# Altium project DAPLink-STM32F103CBT6.PrjPcb
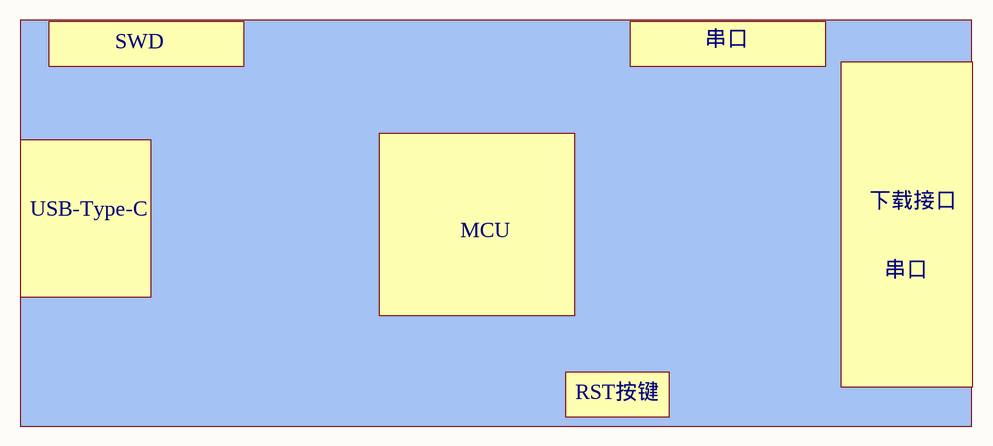
[diagram p0: 01-CoverPage.SchDoc]
website: aiskylab.com
2 sheets, 37 parts. Net scope: global (net labels, ports and power ports of the same name join across sheets).
Board file: DAPLink-STM32F103CBT6.PcbDoc
Sheets:
  01-CoverPage.SchDoc
  02-DAPLink-STM32F103CBT6.SchDoc

## Sheet 01-CoverPage.SchDoc: =DocumentName
size A3; ApprovedBy: 雪域蓝天; CheckedBy: 雪域蓝天; Author: 雪域蓝天; CompanyName: AISkyLab; DrawnBy: 雪域蓝天; Engineer: 雪域蓝天; Organization: AISkyLab; Address1: 海淀; Address3: 北京; Address4: 中国; DocumentNumber: 1; Revision: V1I1; SheetNumber: 1; SheetTotal: 2; ENG_APP_DATE: --/--/--; DSN_APP_DATE: --/--/--; CHK_APP_DATE: --/--/--; website: aiskylab.com

### Notes on the sheet
- 串口
- SWD
- USB-Type-C
- MCU
- 下载接口
- RST按键
- 公
- 设计
- 日期
- 司
- 绘制
- 审核
- 批准
- 标题(Title):
- Size:
- Date:
- A3
- Number:
- Time:
- Revision:
- Sheet
- of
- File:

## Sheet 02-DAPLink-STM32F103CBT6.SchDoc: =DocumentName
size A3; ApprovedBy: 雪域蓝天; CheckedBy: 雪域蓝天; Author: 雪域蓝天; CompanyName: AISkyLab; DrawnBy: 雪域蓝天; Engineer: 雪域蓝天; Organization: AISkyLab; Address1: 海淀; Address2: 北京; Address4: 中国; DocumentNumber: 2; Revision: V1I1; SheetNumber: 2; SheetTotal: 2; ENG_APP_DATE: --/--/--; DSN_APP_DATE: --/--/--; CHK_APP_DATE: --/--/--
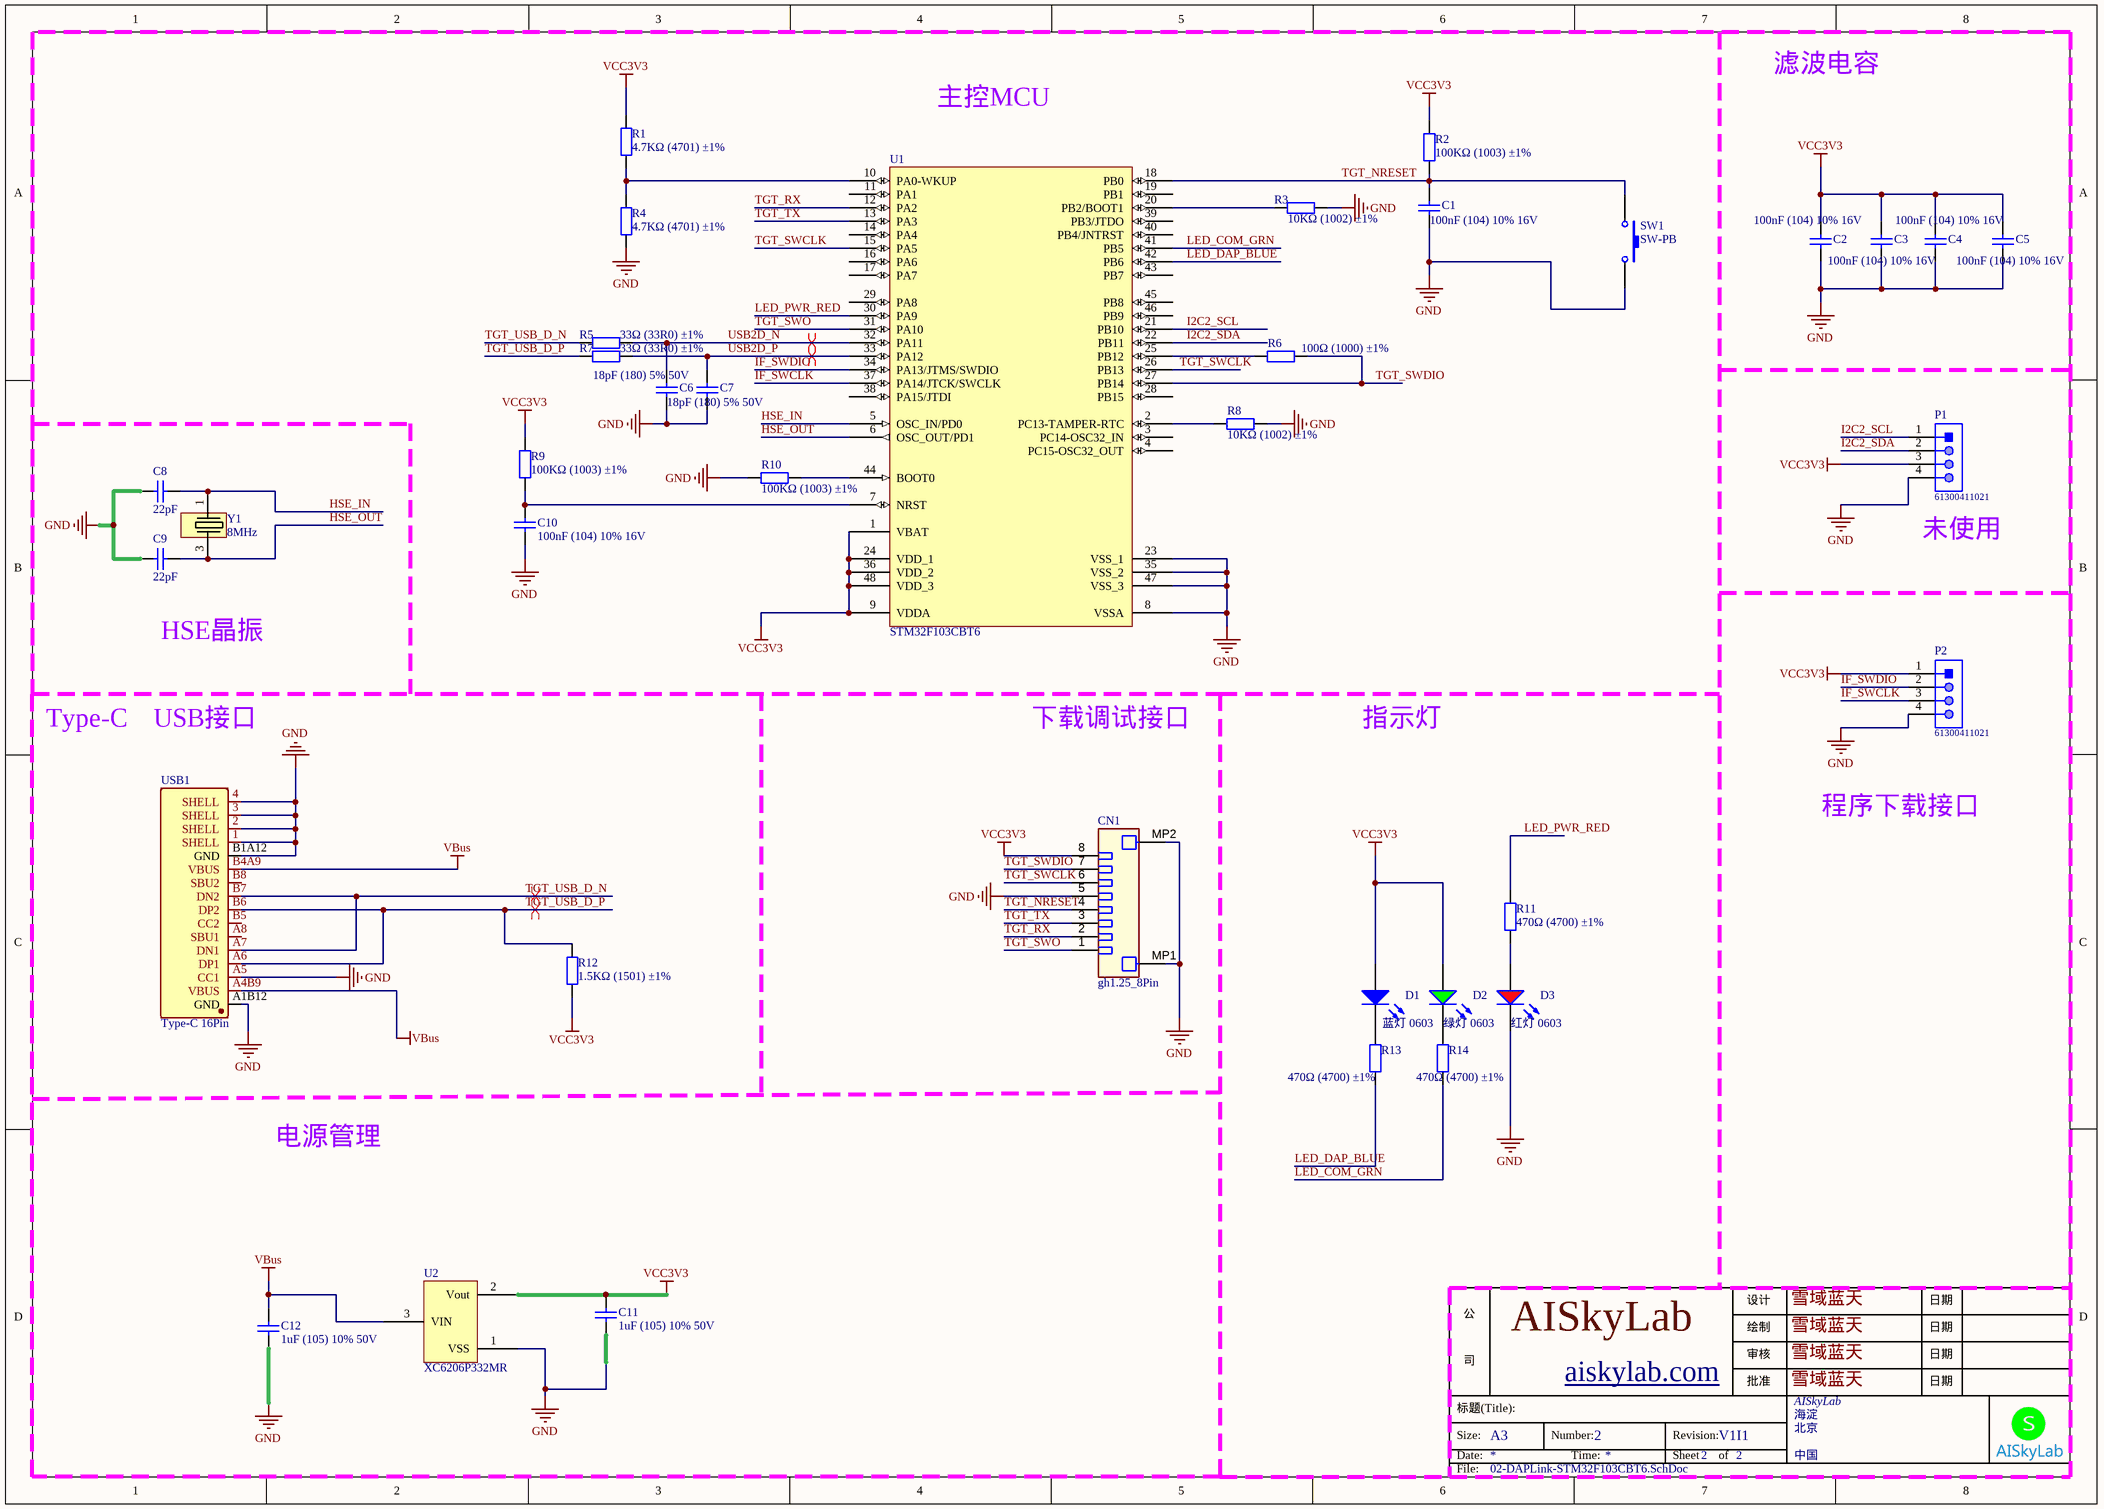
[diagram p1: 02-DAPLink-STM32F103CBT6.SchDoc]

### Parts
C1  100nF (104) 10% 16V  [0402_C]
C2  100nF (104) 10% 16V  [0402_C]
C3  100nF (104) 10% 16V  [0402_C]
C4  100nF (104) 10% 16V  [0402_C]
C5  100nF (104) 10% 16V  [0402_C]
C6  18pF (180) 5% 50V  [0402_C]
C7  18pF (180) 5% 50V  [0402_C]
C8  22pF  [0603_C]
C9  22pF  [0603_C]
C10  100nF (104) 10% 16V  [0402_C]
C11  1uF (105) 10% 50V  [0603_C]
C12  1uF (105) 10% 50V  [0603_C]
CN1  gh1.25_8Pin  [GH1.25_SMD_R_8Pin]
D1  蓝灯 0603  [0603_LED_S1]
D2  绿灯 0603  [0603_LED_S1]
D3  红灯 0603  [0603_LED_S1]
P1  61300411021  [HDR-2.54-1x4-VB2B]
P2  61300411021  [HDR-2.54-1x4-VB2B]
R1  4.7KΩ (4701) ±1%  [0402_R]
R2  100KΩ (1003) ±1%  [0402_R]
R3  10KΩ (1002) ±1%  [0402_R]
R4  4.7KΩ (4701) ±1%  [0402_R]
R5  33Ω (33R0) ±1%  [0402_R]
R6  100Ω (1000) ±1%  [0402_R]
R7  33Ω (33R0) ±1%  [0402_R]
R8  10KΩ (1002) ±1%  [0402_R]
R9  100KΩ (1003) ±1%  [0402_R]
R10  100KΩ (1003) ±1%  [0402_R]
R11  470Ω (4700) ±1%  [0402_R]
R12  1.5KΩ (1501) ±1%  [0402_R]
R13  470Ω (4700) ±1%  [0402_R]
R14  470Ω (4700) ±1%  [0402_R]
SW1  SW-PB  [PB_TYCO_FSMSM]
U1  STM32F103CBT6  [STM32F103CBT6-Footprint-1]
U2  XC6206P332MR  [SOT95P245X110-3N]
USB1  Type-C 16Pin  [PCBComponent_1]
Y1  8MHz  [OSC_SI-TIME_SIT1602-2]

### Nets
GND: C1.1 C2.1 C3.1 C4.1 C5.1 C6.1 C7.1 C8.1 C9.1 C10.1 C11.1 C12.1 CN1.5 CN1.MP1 CN1.MP2 D3.K P1.4 P2.4 R3.2 R4.1 R8.2 R10.2 SW1.2 U1.8(VSSA) U1.23(VSS_1) U1.35(VSS_2) U1.47(VSS_3) U2.1(VSS) USB1.1(SHELL) USB1.2(SHELL) USB1.3(SHELL) USB1.4(SHELL) USB1.A1B12(GND) USB1.A5(CC1) USB1.B1A12(GND)
VBus: C12.2 U2.3(VIN) USB1.A4B9(VBUS) USB1.B4A9(VBUS)
VCC3V3: C2.2 C3.2 C4.2 C5.2 C11.2 CN1.8 D1.A D2.A P1.3 P2.1 R1.2 R2.2 R9.2 R12.1 U1.1(VBAT) U1.9(VDDA) U1.24(VDD_1) U1.36(VDD_2) U1.48(VDD_3) U2.2(Vout)
HSE_IN: C8.2 U1.5(OSC_IN/PD0) Y1.1
HSE_OUT: C9.2 U1.6(OSC_OUT/PD1) Y1.3
I2C2_SCL: P1.1 U1.21(PB10)
I2C2_SDA: P1.2 U1.22(PB11)
IF_SWCLK: P2.3 U1.37(PA14/JTCK/SWCLK)
IF_SWDIO: P2.2 U1.34(PA13/JTMS/SWDIO)
LED_COM_GRN: R14.1 U1.41(PB5)
LED_DAP_BLUE: R13.1 U1.42(PB6)
LED_PWR_RED: R11.2 U1.30(PA9)
TGT_NRESET: C1.2 CN1.4 R2.1 SW1.1 U1.18(PB0)
TGT_RX: CN1.2 U1.12(PA2)
TGT_SWCLK: CN1.6 U1.15(PA5) U1.26(PB13)
TGT_SWDIO: CN1.7 R6.2 U1.27(PB14)
TGT_SWO: CN1.1 U1.31(PA10)
TGT_TX: CN1.3 U1.13(PA3)
TGT_USB_D_N: R5.1 USB1.A7(DN1) USB1.B7(DN2)
TGT_USB_D_P: R7.1 R12.2 USB1.A6(DP1) USB1.B6(DP2)
USB2D_N: C6.2 R5.2 U1.32(PA11)
USB2D_P: C7.2 R7.2 U1.33(PA12)
NetC10_2: C10.2 R9.1 U1.7(NRST)
NetD1_K: D1.K R13.2
NetD2_K: D2.K R14.2
NetD3_A: D3.A R11.1
NetR1_1: R1.1 R4.2 U1.10(PA0-WKUP)
NetR3_1: R3.1 U1.20(PB2/BOOT1)
NetR6_1: R6.1 U1.25(PB12)
NetR8_1: R8.1 U1.2(PC13-TAMPER-RTC)
NetR10_1: R10.1 U1.44(BOOT0)

Not connected (* = marked no-connect by the designer): U1 3(PC14-OSC32_IN) 4(PC15-OSC32_OUT) 11(PA1) 14(PA4) 16(PA6) 17(PA7) 19(PB1) 28(PB15) 29(PA8) 38(PA15/JTDI) 39(PB3/JTDO) 40(PB4/JNTRST) 43(PB7) 45(PB8) 46(PB9); USB1 A8(SBU1) B5(CC2) B8(SBU2); Y1 2(GND) 4(GND)

### Layout directives
differential pair; differential pair class USB2Diff: TGT_USB_D_N, TGT_USB_D_P, USB2D_N, USB2D_P

### Notes on the sheet
- 主控MCU
- 滤波电容
- (near P1) 未使用
- HSE晶振
- Type-C    USB接口
- 下载调试接口
- 指示灯
- 程序下载接口
- 电源管理
- 公
- 设计
- 日期
- 司
- 绘制
- 审核
- 批准
- 标题(Title):
- Size:
- Date:
- A3
- Number:
- Time:
- Revision:
- Sheet
- of
- File:

### Library data of the parts
C1-C5 C10 = 0402 100nF (104) 10% 16V: 贴片电容; ComponentLink1Description: 供应商链接; ComponentLink1URL: http://www.szlcsc.com/product/details_1877.html; Package: 0402; Supplier: LC; SuppliersPartNumber: C1525
C6 C7 = 0402 18pF (180) 5% 50V: 贴片电容; ComponentLink1Description: 供应商链接; ComponentLink1URL: http://www.szlcsc.com/product/details_1901.html; Package: 0402; Supplier: LC; SuppliersPartNumber: C1549
C8 C9 = Cap: Capacitor; Published: 8-Jun-2000; LatestRevisionDate: 17-Jul-2002; LatestRevisionNote: Re-released for DXP Platform.; PackageReference: RAD-0.3; Publisher: Altium Limited; Value: 22pF
C11 C12 = 0603 1uF (105) 10% 50V: 贴片电容; ComponentLink1Description: 供应商链接; ComponentLink1URL: http://www.szlcsc.com/product/details_16531.html; Package: 0603; Supplier: LC; SuppliersPartNumber: C15849
D1 = 0603 蓝灯: 发光二极管; ComponentLink1Description: 供应商链接; ComponentLink1URL: http://www.szlcsc.com/product/details_73150.html; Package: 0603; Supplier: LC; SuppliersPartNumber: C72041
D2 = 0603 绿灯: 发光二极管; ComponentLink1Description: 供应商链接; ComponentLink1URL: http://www.szlcsc.com/product/details_73152.html; Package: 0603; Supplier: LC; SuppliersPartNumber: C72043
D3 = 0603 红灯: 发光二极管; ComponentLink1Description: 供应商链接; ComponentLink1URL: http://www.szlcsc.com/product/details_2659.html; Package: 0603; Supplier: LC; SuppliersPartNumber: C2286
P1 P2 = HDR-1x4Pos: THT Angled Pin Header WR-PHD, Pitch 2.54 mm, Single Row, 4 pins; Manufacturer: Wurth Elektronik; Gender: Male; Pin Number: 4; Withstanding Voltage: 500VAC; Working Voltage: 250VAC; Contact Resistance: 20mOhm; Pitch: 2.54mm; Rated Current: 3A; Manufacturer URL: http://www.we-online.de; Mounting Technology: THT; Publisher: WurthElektronik; Operating Temperature: -40to105degC; Packaging: Bag; Row Number: Single; Package Reference: 61300411021; Part Number: 61300411021; Orientation: Angled; Datasheet URL: https://katalog.we-online.de/em/datasheet/6130xx11021.pdf
R1 R4 = 0402 4.7KΩ (4701) 1%: 贴片电阻; ComponentLink1Description: 供应商链接; ComponentLink1URL: http://www.szlcsc.com/product/details_26643.html; Package: 0402; Supplier: LC; SuppliersPartNumber: C25900
R2 R9 R10 = 0402 100KΩ (1003) 1%: 贴片电阻; ComponentLink1Description: 供应商链接; ComponentLink1URL: http://www.szlcsc.com/product/details_26484.html; Package: 0402; Supplier: LC; SuppliersPartNumber: C25741
R3 R8 = 0402 10KΩ (1002) 1%: 贴片电阻; ComponentLink1Description: 供应商链接; ComponentLink1URL: http://www.szlcsc.com/product/details_26487.html; Package: 0402; Supplier: LC; SuppliersPartNumber: C25744
R5 R7 = 0402 33Ω (33R0) 1%: 贴片电阻; ComponentLink1Description: 供应商链接; ComponentLink1URL: http://www.szlcsc.com/product/details_25848.html; Package: 0402; Supplier: LC; SuppliersPartNumber: C25105
R6 = 0402 100Ω (1000) 1%: 贴片电阻; ComponentLink1Description: 供应商链接; ComponentLink1URL: http://www.szlcsc.com/product/details_25819.html; Package: 0402; Supplier: LC; SuppliersPartNumber: C25076
R11 R13 R14 = 0402 470Ω (4700) 1%: 贴片电阻; ComponentLink1Description: 供应商链接; ComponentLink1URL: http://www.szlcsc.com/product/details_25860.html; Package: 0402; Supplier: LC; SuppliersPartNumber: C25117
R12 = 0402 1.5KΩ (1501) 1%: 贴片电阻; ComponentLink1Description: 供应商链接; ComponentLink1URL: http://www.szlcsc.com/product/details_26610.html; Package: 0402; Supplier: LC; SuppliersPartNumber: C25867
SW1 = SW-PB: Switch; Published: 24-Mar-1999; LatestRevisionDate: 17-Jul-2002; LatestRevisionNote: Re-released for DXP Platform.; PackageReference: SPST-2; Publisher: Altium Limited; PackageDescription: Switch; 2 Leads
U1 = CMP-020-00023-1: ARM® 32-bit Cortex®-M3 CPU Core,72 MHz maximum frequency; RAM Size: 64 or 128 Kbytes of Flash memory, 20 Kbytes of SRAM; Pins: 48; Case/Package: LQFP48
U2 = CMP-019-00049-1: 低压差线性稳压(LDO),最大输入8V，输出电流100mA; Max Supply Voltage: 8V; Output Voltage: 3.3V; Pins: 3; Max Operating Temperature: 80°C; Case/Package: SOT-23; Min Operating Temperature: -25°C
USB1 = TYPE-C16PIN: ComponentLink1Description: 嘉立创; ComponentLink1URL: https://item.szlcsc.com/372551.html; Datasheet: javascript:fileModule.downloadFileNoRemark('https://atta.szlcsc.com/upload/public/pdf/source/20190521/C393939_7B9043D4CF1026AF443AB60D91FBCD5C.pdf%3FExpires%3D4070880000%26OSSAccessKeyId%3DLTAIJDIkh7KmGS1H%26Signature%3DcQcE%252FNX1dDNXtBUBosJ1RmuR16Q%253D%26response-content-disposition%3Dattachment%253Bfilename%253DC393939_TYPE-C%2525E6%2525AF%25258D%2525E5%2525BA%2525A716PIN%2525E5%2525BF%2525AB%2525E5%252585%252585%2525E9%252597%2525AA%2525E5%252585%252585USB3.0%2525E6%2525B2%252589%2525E6%25259D%2525BF%2525E6%2525AF%25258D%2525E5%2525BA%2525A7%2525E8%2525BF%25259E%2525E6%25258E%2525A5%2525E5%252599%2525A8_2019-05-21.PDF','60D38A6780882313296C67311B688FC3','new_pdf_doc_pdf','');buriedPoint({ty: 'click',op: 'download_pdf',data: 'C393939'});
Y1 = XTAL-4: VALUE: 8MHz